# Altium schematic sheet [9] Discharge_Circuit.SchDoc
size A4
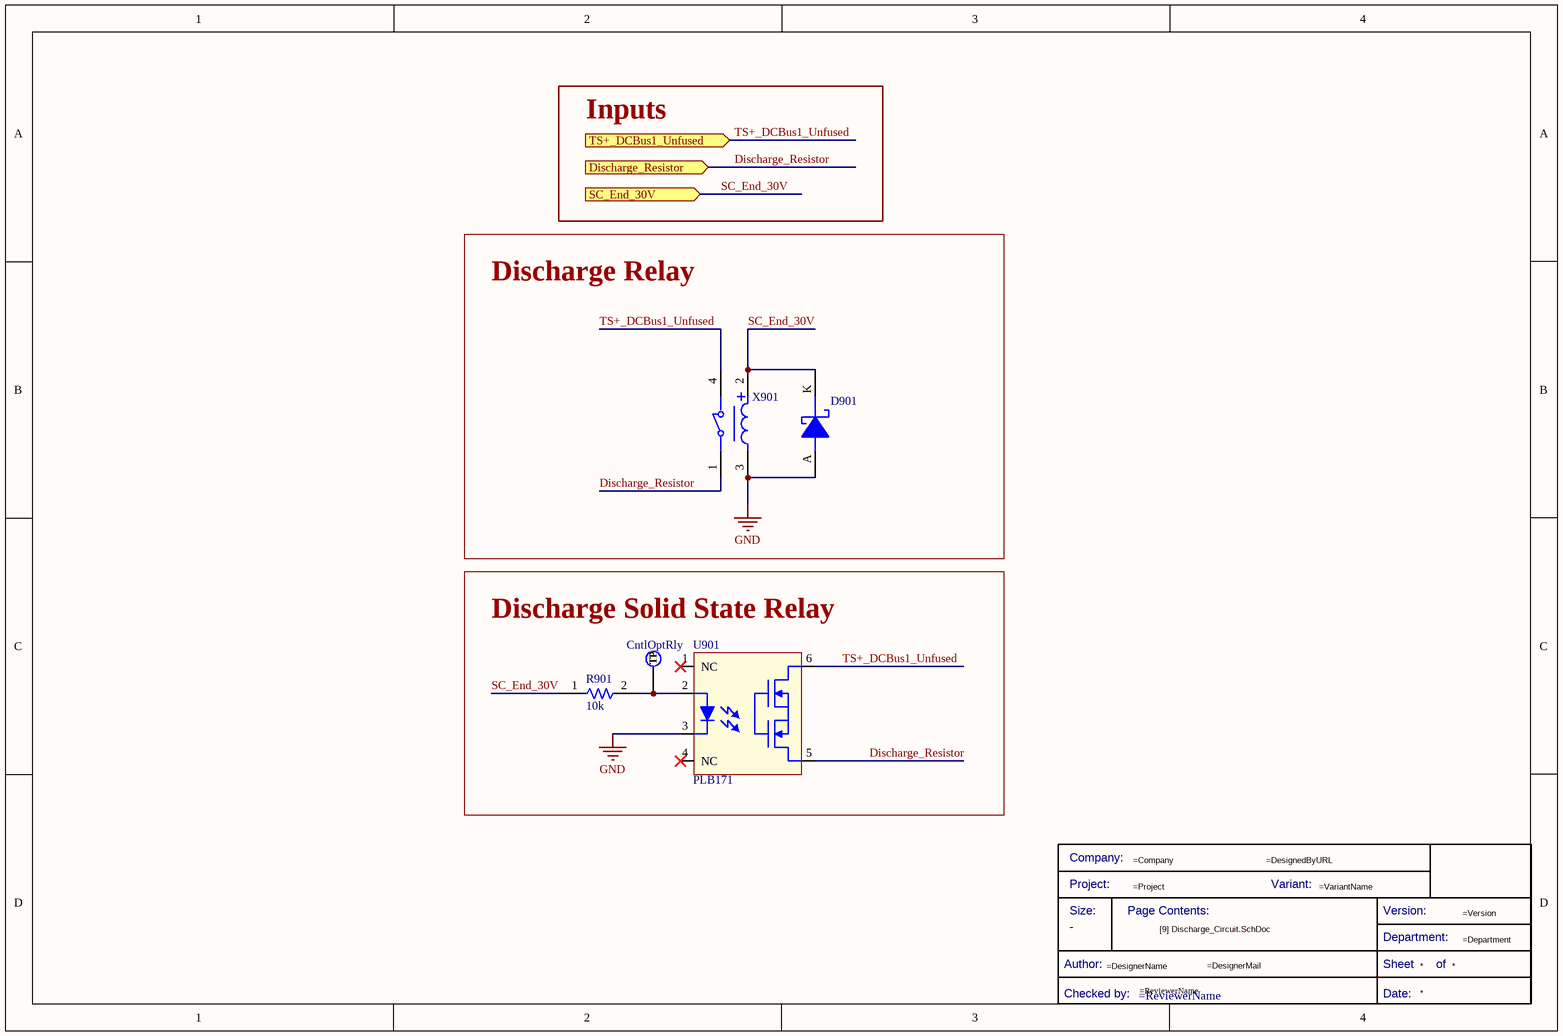
[diagram p0: [9] Discharge_Circuit.SchDoc]

## Parts
*  Title Block_template  (value not drawn)  (graphical)
CntlOptRly  TestPoint  [TestPoint]  (value not drawn)  (no BOM)
D901  DSC-0.5/30-SOD123  [DSC-SOD123]  (value not drawn)
R901  Resistance: 10k  [0805]  (hidden comment: R10k_0805_0.25W)
U901  PLB171  [PLB171]
X901  HV-Relay-SPST-NC-24V  [HV-Relay-SPST-NC-24V]  (value not drawn)

## Blocks framed on the sheet
Discharge Relay: D901 X901
Discharge Solid State Relay: CntlOptRly R901 U901

## Ports
Discharge_Resistor (in, see TSAL_Control[1D]), SC_End_30V (in, see TSAL_Control[1D]), TS+_DCBus1_Unfused (in, see TSAL_Control[1D])

## Nets
GND: D901.A U901.3(CNTRL-) X901.3
Discharge_Resistor: U901.5(Load-) X901.1 ; port Discharge_Resistor
SC_End_30V: D901.K R901.1 X901.2 ; port SC_End_30V
TS+_DCBus1_Unfused: U901.6(Load+) X901.4 ; port TS+_DCBus1_Unfused
NetCntlOptRly_1: CntlOptRly.1(TP) R901.2 U901.2(CNTRL+)

Not connected (* = marked no-connect by the designer): U901 1(NC)* 4(NC)*

## Notes on the sheet
- Inputs
- (in symbol CMP-00043-8) Company:; Project:; Variant:; Size:; Page Contents:; Version:; Department:; Author:; Sheet; of; Checked by:; Date:

## Library data of the parts
* = CMP-00043-8: Standard Title Block; .SCHcheck: GP; Checked by:: =ReviewerName; Size: -; Design Item ID: Title Block_template; .PCBcheck: GP; .Creator: GP; Source: e-Tech_Racing.SchLib; Category: Title Block
CntlOptRly = CMP-00042-2: Test Point 1x1 mm; .PCBcheck: GP; Source: e-Tech_Racing.SchLib; Design Item ID: TestPoint; .Creator: GP; Category: TestPoint; .SCHcheck: GP
D901 = CMP-00165-2: VR=30V IF=500mA 30pF P=410mW; Peak Non-Repetitive Surge Current: 5.5A; .Creator: GP; Voltage Rating (DC): 30V; Current Rating: 500mA; Max Reverse Leakage Current: 130uA; Element Configuration: Single; Polarity: Standard; Forward Voltage: 430mV; ComponentLink5Description: https://datasheet.ciiva.com/910/mbr0530-910516.pdf?src-supplier=Digi-Key; ComponentLink2Description: Where buy it; ComponentLink1Description: Datasheet; Pricing 1: 1=0,34400, 10=0,23900, 100=0,12200, 500=0,10000 (USD); ComponentLink7Description: https://datasheet.ciiva.com/8300/mbr0530-8300905.pdf?src-supplier=Avnet; ComponentLink3URL: https://datasheet.ciiva.com/30479/0900766b810e2512-30479401.pdf?src-supplier=RSComponents; Stock 1: 9; Max Reverse Voltage (DC): 30V; Max Repetitive Reverse Voltage (Vrrm): 30V; Width: 1.6mm; ComponentLink6URL: https://datasheet.ciiva.com/25931/mbr0530-25931989.pdf?src-supplier=Avnet+Europe; Contact Plating: Tin,Matte; Height: 1.03mm; Category: Diode; ComponentLink1URL: *; Max Surge Current: 5.5A; ComponentLink4URL: https://datasheet.ciiva.com/34301/974753-34301826.pdf?src-supplier=Jameco; ComponentLink4Description: https://datasheet.ciiva.com/34301/974753-34301826.pdf?src-supplier=Jameco; ComponentLink5URL: https://datasheet.ciiva.com/910/mbr0530-910516.pdf?src-supplier=Digi-Key; Length: 2.7mm; ComponentLink10URL: https://datasheet.ciiva.com/910/mbr0530-910518.pdf?src-supplier=Digi-Key; ComponentLink2URL: *; ComponentLink7URL: https://datasheet.ciiva.com/8300/mbr0530-8300905.pdf?src-supplier=Avnet; Max Forward Surge Current (Ifsm): 5.5A; Design Item ID: DSC-0.5/30-SOD123; REACH SVHC: No SVHC; Package Quantity: 1; RoHS Compliant: Yes; Lead Free: Lead Free; Max Reverse Current: 130uA; ComponentLink8Description: https://datasheet.ciiva.com/17318/mbr0530-17318568.pdf?src-supplier=Future+Electronics; Series: -; Average Rectified Current: 500mA; Source: Filter components.SchLib; Output Current: 500mA; ComponentLink9URL: https://datasheet.ciiva.com/15144/getdatasheetpartid-86760-15144598.pdf?src-supplier=Verical; Weight: 0.03g; ComponentLink6Description: https://datasheet.ciiva.com/25931/mbr0530-25931989.pdf?src-supplier=Avnet+Europe; ComponentLink9Description: https://datasheet.ciiva.com/15144/getdatasheetpartid-86760-15144598.pdf?src-supplier=Verical; Mount: Surface Mount; ComponentLink3Description: https://datasheet.ciiva.com/30479/0900766b810e2512-30479401.pdf?src-supplier=RSComponents; Forward Current: 500mA; Radiation Hardening: No; ComponentLink8URL: https://datasheet.ciiva.com/17318/mbr0530-17318568.pdf?src-supplier=Future+Electronics; ComponentLink10Description: https://datasheet.ciiva.com/910/mbr0530-910518.pdf?src-supplier=Digi-Key
R901 = CMP-009-00035-5: Resistor, 10K, 0.25W, Thick Film, 0805 Rohs Compliant: Yes
U901 = CMP-00229-1: Transistor Output SSR; Reach SVHC Compliant: Yes; Optoelectronic Device Type: TRANSISTOR OUTPUT SSR
X901 = CMP-00224-4: Dry Reed Relay, SPST-NC, 3500V switching voltage, 3A, 10kV isolation coil-contacts, 5504-24-1; Terminal Finish: Tin; Relay Type: DRY REED RELAY; RoHS Compliant: Yes; Reach SVHC Compliant: Yes; JESD-609 Code: e3